# EAGLE design WeatherReportR03 (EAGLE 9.3.0)
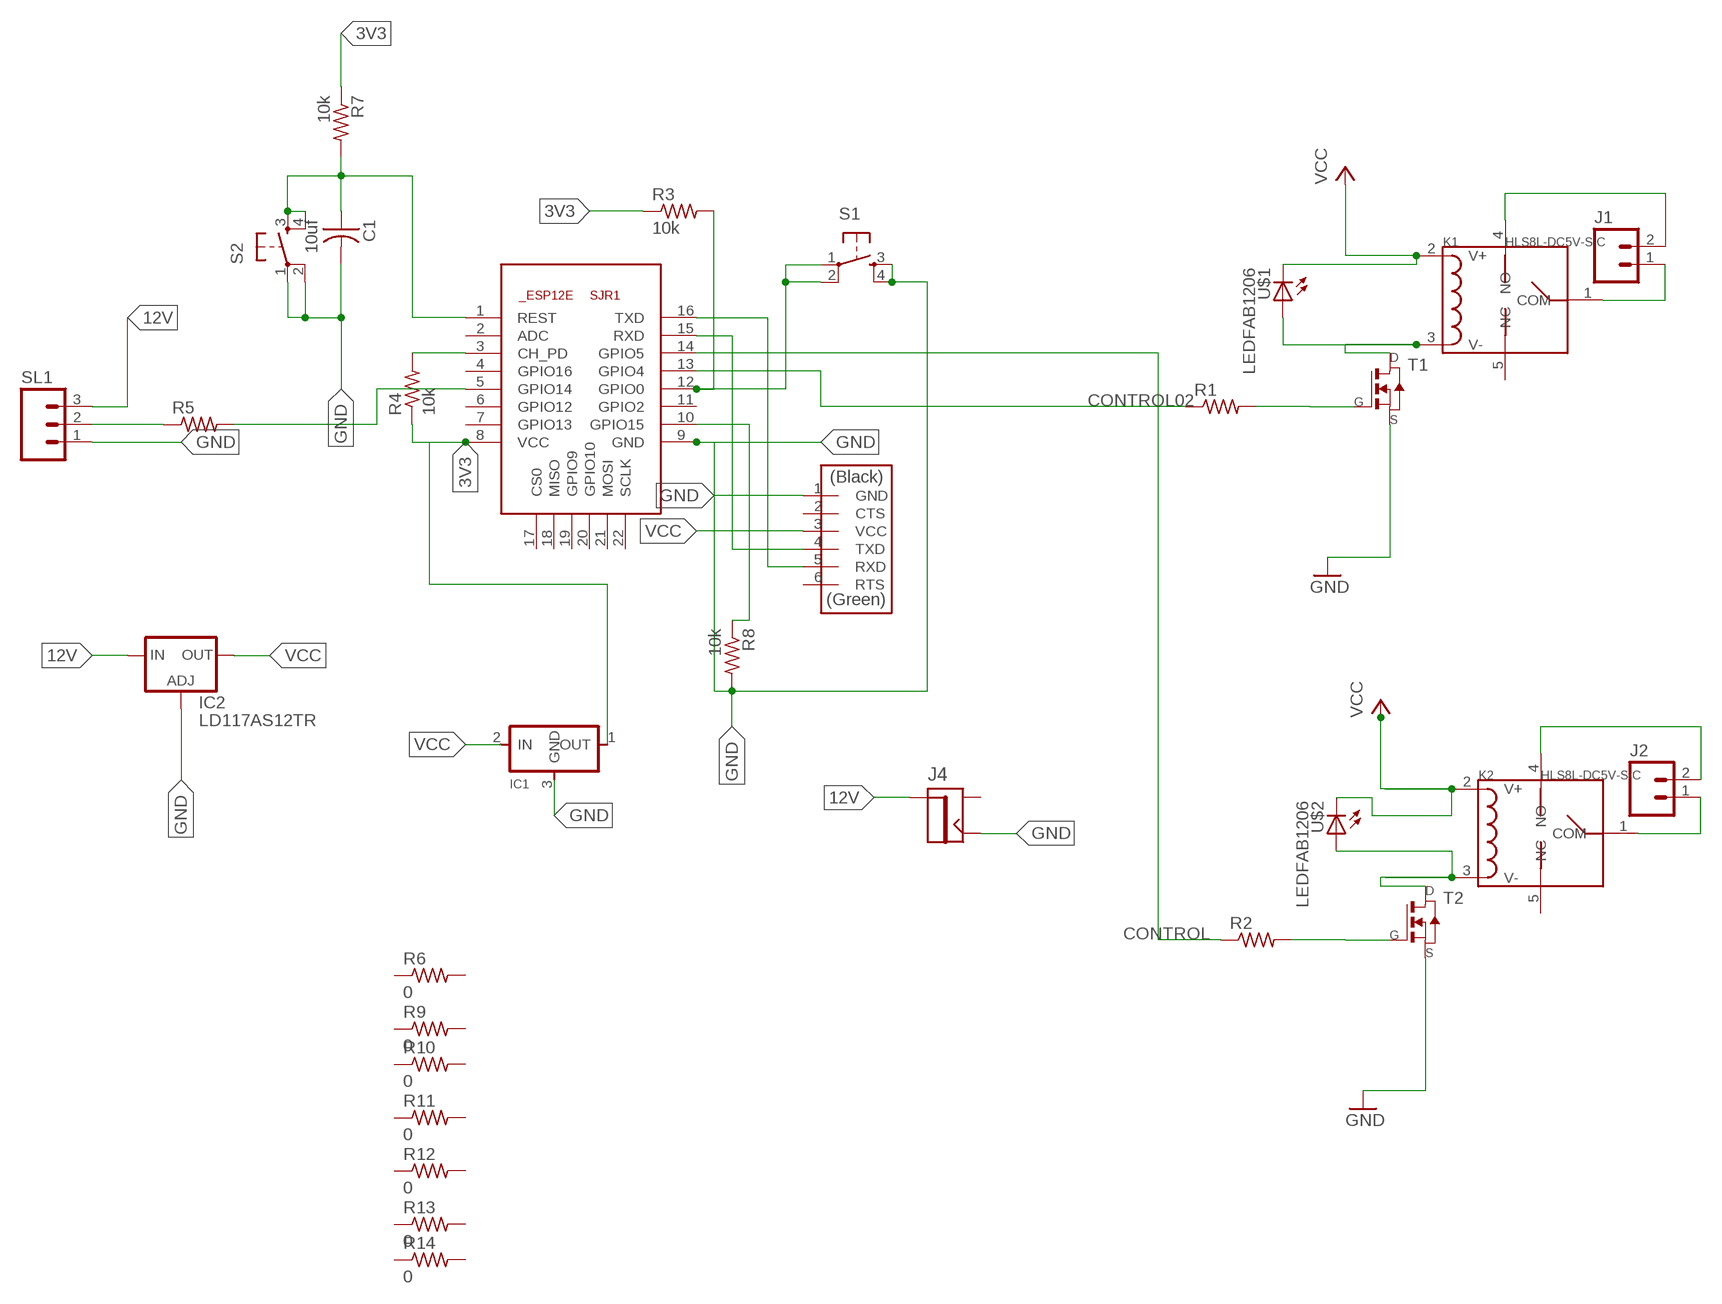
[diagram p0: schematic, sheet 1]

## Parts
C1  10uf  CAP-US1206FAB  [C1206FAB]
IC1  REGULATORSOT23  [SOT23]
IC2  LD117AS12TR  [SOT223]
J1  M02POLAR_LOCK  [MOLEX-1X2_LOCK]
J2  M02POLAR_LOCK  [MOLEX-1X2_LOCK]
J4  JACK2.1MM  [JACK_2.1MM]
K1  HLS8L-DC5V-S-C  RELAY-HLS8L-DC5V-S-C(5P-19X15MM)  [REY5-19.0X15.0X15.0MM]
K2  HLS8L-DC5V-S-C  RELAY-HLS8L-DC5V-S-C(5P-19X15MM)  [REY5-19.0X15.0X15.0MM]
R1  RES-US1206FAB  [R1206FAB]
R2  RES-US1206FAB  [R1206FAB]
R3  10k  RES-US1206FAB  [R1206FAB]
R4  10k  RES-US1206FAB  [R1206FAB]
R5  RES-US1206FAB  [R1206FAB]
R6  0  RES-US1206FAB  [R1206FAB]
R7  10k  RES-US1206FAB  [R1206FAB]
R8  10k  RES-US1206FAB  [R1206FAB]
R9  0  RES-US1206FAB  [R1206FAB]
R10  0  RES-US1206FAB  [R1206FAB]
R11  0  RES-US1206FAB  [R1206FAB]
R12  0  RES-US1206FAB  [R1206FAB]
R13  0  RES-US1206FAB  [R1206FAB]
R14  0  RES-US1206FAB  [R1206FAB]
S1  6MM_SWITCH6MM_SWITCH  [6MM_SWITCH]
S2  6MM_SWITCH6MM_SWITCH  [6MM_SWITCH]
SJR1  ESP8266-12EESP12E  [ESP8266-ESP12E]
SL1  M03  [03P]
T1  NMOSFETSOT23  [SOT-23]
T2  NMOSFETSOT23  [SOT-23]
U$1  LEDFAB1206  [LED1206FAB]
U$2  LEDFAB1206  [LED1206FAB]
U$7  FTDI-SMD-HEADER  [1X06SMD]

## Nets
3V3: IC1.1(OUT) R3.1 R4.1 R7.1 SJR1.8(VCC)
12V: IC2.3(IN) J4.PIN SL1.3
CONTROL: R2.1 SJR1.14(GPIO5)
CONTROL02: R1.1 SJR1.13(GPIO4)
GND: C1.2 IC1.3(GND) IC2.1(ADJ) J4.CONTACT R8.2 S1.3(S) S1.4(S1) S2.1(P) S2.2(P1) SJR1.9(GND) SL1.1 T1.2(S) T2.2(S) U$7.1(GND)
N$1: R1.2 T1.3(G)
N$2: K1.3(V-) T1.1(D) U$1.1(A)
N$3: SJR1.16(TXD) U$7.5(RXD)
N$4: SJR1.15(RXD) U$7.4(TXD)
N$5: R8.1 SJR1.10(GPIO15)
N$6: J1.2 K1.4(NO)
N$7: J1.1 K1.1(COM)
N$8: R3.2 S1.1(P) S1.2(P1) SJR1.12(GPIO0)
N$9: R5.2 SJR1.5(GPIO14)
N$10: K2.3(V-) T2.1(D) U$2.1(A)
N$11: C1.1 R7.2 S2.3(S) S2.4(S1) SJR1.1(REST)
N$12: R2.2 T2.3(G)
N$13: J2.2 K2.4(NO)
N$14: J2.1 K2.1(COM)
N$15: R4.2 SJR1.3(CH_PD)
N$17: R5.1 SL1.2
VCC: IC1.2(IN) IC2.4(OUT) K1.2(V+) K2.2(V+) U$1.2(C) U$2.2(C) U$7.3(VCC)
Unconnected: J4.SHUNT K1.5(NC) K2.5(NC) R6.1 R6.2 R9.1 R9.2 R10.1 R10.2 R11.1 R11.2 R12.1 R12.2 R13.1 R13.2 R14.1 R14.2 SJR1.2(ADC) SJR1.4(GPIO16) SJR1.6(GPIO12) SJR1.7(GPIO13) SJR1.11(GPIO2) SJR1.17(CS0) SJR1.18(MISO) SJR1.19(GPIO9) SJR1.20(GPIO10) SJR1.21(MOSI) SJR1.22(SCLK) U$7.2(CTS) U$7.6(RTS)

## Library data of the parts
C1 = fab:CAP-US
IC1 = fab:REGULATOR
IC2 = v-reg:LD117A?*: Low drop fixed and adjustable positive voltage regulators 1 A Source: http://www.st.com/stonline/products/literature/ds/7194/ld1117axx.pdf
J1 J2 = SparkFun-Connectors:M02: Standard 2-pin 0.1" header. Use with - straight break away headers ( PRT-00116) - right angle break away headers (PRT-00553) - swiss pins (PRT-00743) - machine pins (PRT-00117) - female headers (PRT-00115) Molex polarized connector foot print use with: PRT-08233 with associated crimp pins and housings. 2.54_SCREWTERM for use with PRT-10571. 3.5mm Screw Terminal footprints for PRT-08084 5mm Screw Terminal footprints for use with PRT-08432
J4 = fab:JACK
K1 K2 = Seeed-OPL-Relay:RELAY-HLS8L-DC5V-S-C(5P-19X15MM): 315030000; MPN: HLS8L-DC5V-S-C
R1-R14 = fab:RES-US: Resistor (US Symbol) Variants with postfix FAB are widened to allow the routing of internal traces
S1 S2 = fab:6MM_SWITCH: OMRON SWITCH
SJR1 = esp12e:ESP8266-12E: ESP8266-12E Library for Eagle CAD The author not responsible for any damages or errors!. Created by Suhail jr.lt;/author>
SL1 = con-amp-quick:M03: AMP QUICK CONNECTOR; OC_FARNELL: unknown; OC_NEWARK: unknown
T1 T2 = fab:NMOSFET: MOS FET
U$1 U$2 = fab:LED: LED
U$7 = fab:FTDI-SMD-HEADER

## Board
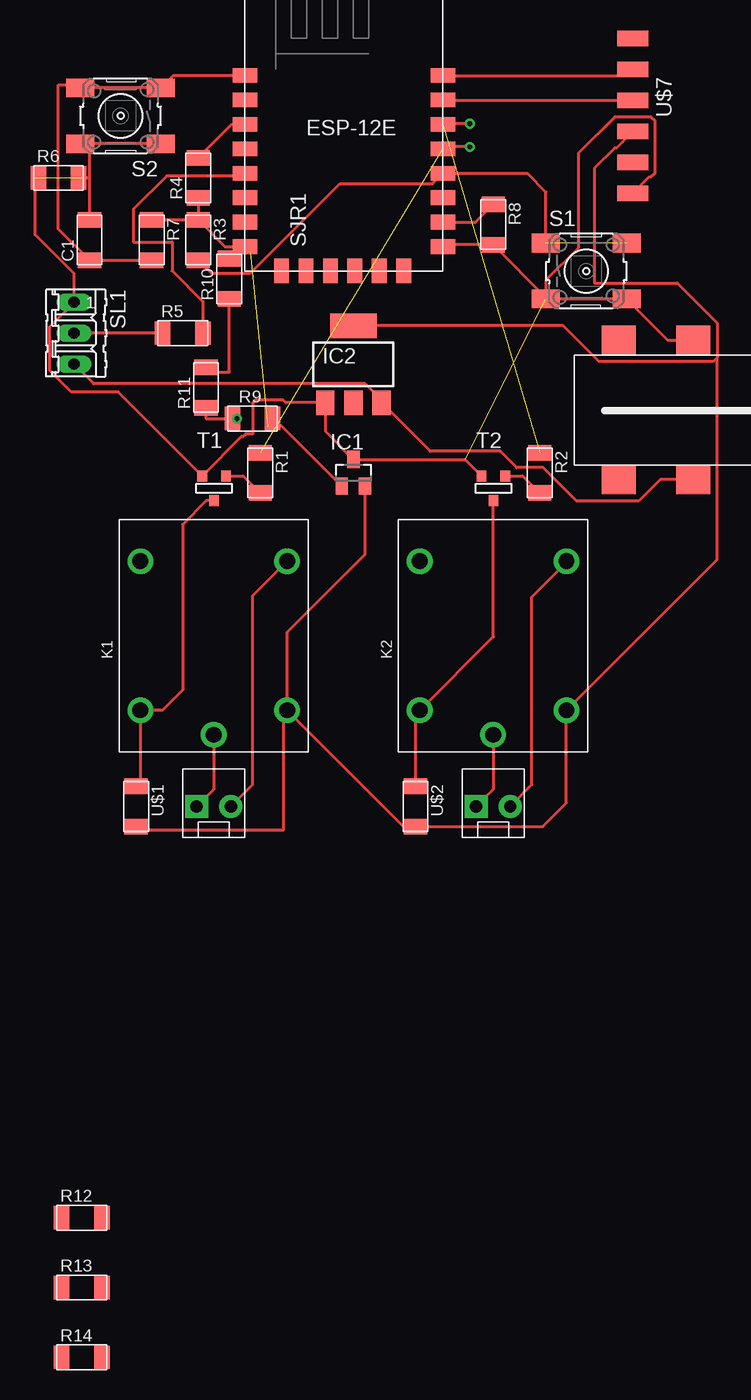
[diagram p1: board, top side]

No outline drawn. Coordinates in mm, seen from the top.
Copper layers (1*16): Top 0.035mm / dielectric 1.5mm / Bottom 0.035mm
Design rules "fabmodule": minimum track width 10mil, minimum drill 0.4mm, track to track 0.42mm, track to pad 0.42mm, pad to pad 0.42mm, via to via 0.42mm, smd to smd 0.42mm, copper to edge 40mil, drill to drill 0.8mm, minimum pad ring 10mil, minimum via ring 8mil, stop-mask expansion 4mil, vias tented up to drill 0mil, thermal gap 10mil

### Footprints (pad centres in the part's own frame; a part is rotated, then mirrored left to right if it is on the bottom)
C1206FAB = smd 1.27 x 1.905: 1 -1.651,0; 2 1.651,0
SOT23 = smd 1 x 1.4: 1 -0.95,-1.1; 2 0.95,-1.1; 3 0,1.1
SOT223 = smd 1.5 x 2: 1 -2.3,-3.15; 2 0,-3.15; 3 2.3,-3.15 | smd 3.8 x 2: 4 0,3.15
MOLEX-1X2_LOCK = drill 1.016 pad 1.88 square: 1 -0.127,0 | drill 1.016 pad 1.88: 2 2.667,0
JACK_2.1MM = smd 2.388 x 2.794: CONTACT 5.766,-2.413; PIN -5.639,-2.413; PIN1 -5.639,3.683; SHUNT 5.766,3.683
REY5-19.0X15.0X15.0MM = drill 1.3 pad 2.1: 1 -8.1,0; 2 -6.1,-6; 3 -6.1,6; 4 6.1,-6; 5 6.1,6
R1206FAB = smd 1.27 x 1.905: 1 -1.651,0; 2 1.651,0
6MM_SWITCH = smd 2.286 x 1.524: 1 -3.302,2.286; 2 3.302,2.286; 3 -3.302,-2.286; 4 3.302,-2.286
ESP8266-ESP12E = smd 2 x 1.2: 1 -7.62,5.84; 2 -7.62,3.84; 3 -7.62,1.84; 4 -7.62,-0.16; 5 -7.62,-2.16; 6 -7.62,-4.16; 7 -7.62,-6.16; 8 -7.62,-8.16; 9 8.58,-8.16; 10 8.58,-6.16; 11 8.58,-4.16; 12 8.58,-2.16; 13 8.58,-0.16; 14 8.58,1.84; 15 8.58,3.84; 16 8.58,5.84 | smd 1.2 x 2: 17 -4.62,-10.16; 18 -2.62,-10.16; 19 -0.62,-10.16; 20 1.38,-10.16; 21 3.38,-10.16; 22 5.38,-10.16
03P = drill 0.914 long: 1 -2.54,0; 2 0,0; 3 2.54,0
SOT-23 = smd 0.787 x 0.889: 1 0.025,-1.016; 2 -0.94,1.016; 3 0.991,1.016
LED1206FAB = smd 1.27 x 1.905: 1 -1.651,0; 2 1.651,0
1X06SMD = smd 2.54 x 1.27: 1 0,6.35; 2 0,3.81; 3 0,1.27; 4 0,-1.27; 5 0,-3.81; 6 0,-6.35

### Placement (x,y rotation side)
C1  -1.27,44.45 90 top
IC1  20.32,25.4 0 top
IC2  20.32,34.29 0 top
J1  7.62,-1.91 0 top
J2  30.48,-1.91 0 top
J4  45.72,30.48 90 top
K1  8.89,12.06 90 top
K2  31.75,12.06 90 top
R1  12.7,25.4 270 top
R2  35.56,25.4 270 top
R3  7.62,44.45 270 top
R4  7.62,49.53 90 top
R5  6.35,36.83 0 top
R6  -3.81,49.53 0 top
R7  3.81,44.45 270 top
R8  31.75,45.72 270 top
R9  12.06,29.84 0 top
R10  10.16,41.27 90 top
R11  8.26,32.38 90 top
R12  -1.91,-35.56 0 top
R13  -1.91,-41.27 0 top
R14  -1.91,-46.99 0 top
S1  39.37,41.91 0 top
S2  1.27,54.61 180 top
SJR1  19.05,52.07 0 top
SL1  -2.54,36.83 270 top
T1  8.89,24.13 0 top
T2  31.75,24.13 0 top
U$1  2.54,-1.91 270 top
U$2  25.4,-1.91 270 top
U$7  43.18,54.61 180 top

### Tracks (layer width: path | path; a pad name or v marks a point on that pad's centre or on a via)
3V3  (1 unrouted)
  Top 0.254: R7.1 R3.1 | R4.1 R3.1 | R3.1 9.81,43.91 SJR1.8 11.9,43.44 | IC1.1 14.46,29.21 13.34,29.21
12V
  Top 0.254: J4.PIN 45.4,24.84 43.66,23.1 38.57,23.1 35.85,25.82 33.68,25.82 32.32,27.17 26.59,27.17 IC2.3 22.62,31.36 21.3,32.69 -0.94,32.69 SL1.3
CONTROL  (1 unrouted)
CONTROL02  (1 unrouted)
GND  (2 unrouted)
  Top 0.254: C1.2 -1.27,49.53 | -1.27,49.53 -1.27,51.56 -1.84,52.13 | -1.84,52.13 S2.2 | S2.1 -1.65,52.32 -1.84,52.13 | J4.CONTACT 46.05,36.25 S1.4 S1.3 36.07,39.75 | SJR1.9 27.79,44.07 R8.2 36.07,39.75 | T2.2 29.46,26.5 IC1.3 18.02,28.8 IC2.1 14.78,31.14 14.58,31.34 12.29,31.34 12.06,31.11 12.06,28.57 11.51,28.57 11.28,28.35 11.15,28.35 T1.2 1.08,32.01 -2.75,32.01 -4.51,33.77 -4.51,37.35 -2.54,39.32 SL1.1 -2.54,41.71 -5.71,44.88 -5.71,49.53 | 36.07,39.75 36.07,41.15 38.72,43.8 38.72,51.56 41.68,54.52 44.68,54.52 45,54.2 45,49.94 44.68,49.62 44.54,49.62 U$7.1 | -1.27,49.53 -1.91,49.53
N$1
  Top 0.254: T1.3 11.3,25.15 R1.2
N$2
  Top 0.254: T1.1 8.28,23.11 6.35,21.18 6.35,7.62 4.7,5.96 K1.3 2.89,0.1 U$1.1
N$3
  Top 0.254: SJR1.16 42.67,57.91 U$7.5
N$4
  Top 0.254: SJR1.15 43.15,55.91 U$7.4
N$5
  Top 0.254: SJR1.10 30.29,45.91 R8.1
N$6
  Top 0.254: J1.2 12.06,-0.13 12.06,15.34 K1.4
N$7
  Top 0.254: K1.1 8.89,-0.51 J1.1
N$8  (1 unrouted)
  Top 0.254: R3.2 8.71,41.71 11.85,41.71 19.2,49.06 26.78,49.06 27.59,49.88 | 27.59,49.88 SJR1.12 | S1.1 36.07,48.39 34.58,49.88 27.59,49.88
N$9
  Top 0.254: R5.2 8,39.42 5.49,41.94 5.49,44.28 2.31,44.28 2.31,46.96 5.04,49.7 11.22,49.7 SJR1.5
N$10
  Top 0.254: U$2.1 25.4,5.62 K2.3 31.77,11.99 T2.1
N$11
  Top 0.254: SJR1.1 5.59,57.91 S2.3 S2.4 -2.29,57.15 -3.81,57.15 -3.81,45.34 C1.1 R7.2
N$12
  Top 0.254: T2.3 34.16,25.15 R2.2
N$13
  Top 0.254: J2.2 34.92,-0.13 34.92,15.24 37.75,18.07 K2.4
N$14
  Top 0.254: K2.1 31.75,-0.51 J2.1
N$15
  Top 0.254: R4.2 10.35,53.91 SJR1.3
N$16  (via drill 0.4)
  Top 0.254: v29.84,53.98 27.94,53.98
N$17
  Top 0.254: R5.1 SL1.2
N$18  (via drill 0.4)
  Top 0.254: v29.84,52.07 27.94,52.07
N$20
  Top 0.254: 8.26,33.66 10.16,33.66 10.16,40.01
N$21  (via drill 0.4)
  other vias: 10.79,29.84
N$22
  Top 0.254: 8.26,31.11 8.26,29.84 10.79,29.84
VCC
  Top 0.254: K1.2 24.41,-3.56 U$2.2 35.81,-3.56 37.75,-1.62 K2.2 50.08,18.29 50.08,34.83 | U$1.2 2.79,-3.81 14.61,-3.81 14.61,5.68 K1.2 | K1.2 14.89,12.35 21.27,18.73 IC1.2 | U$7.3 41.82,51.98 41.68,51.98 40.03,50.33 40.03,40.93 46.81,40.93 50.08,37.67 50.08,34.83 | 50.08,34.83 49.76,34.51 40.41,34.51 37.48,37.44 IC2.4